# EAGLE schematic Prototipo_1.0 (EAGLE 6.1)
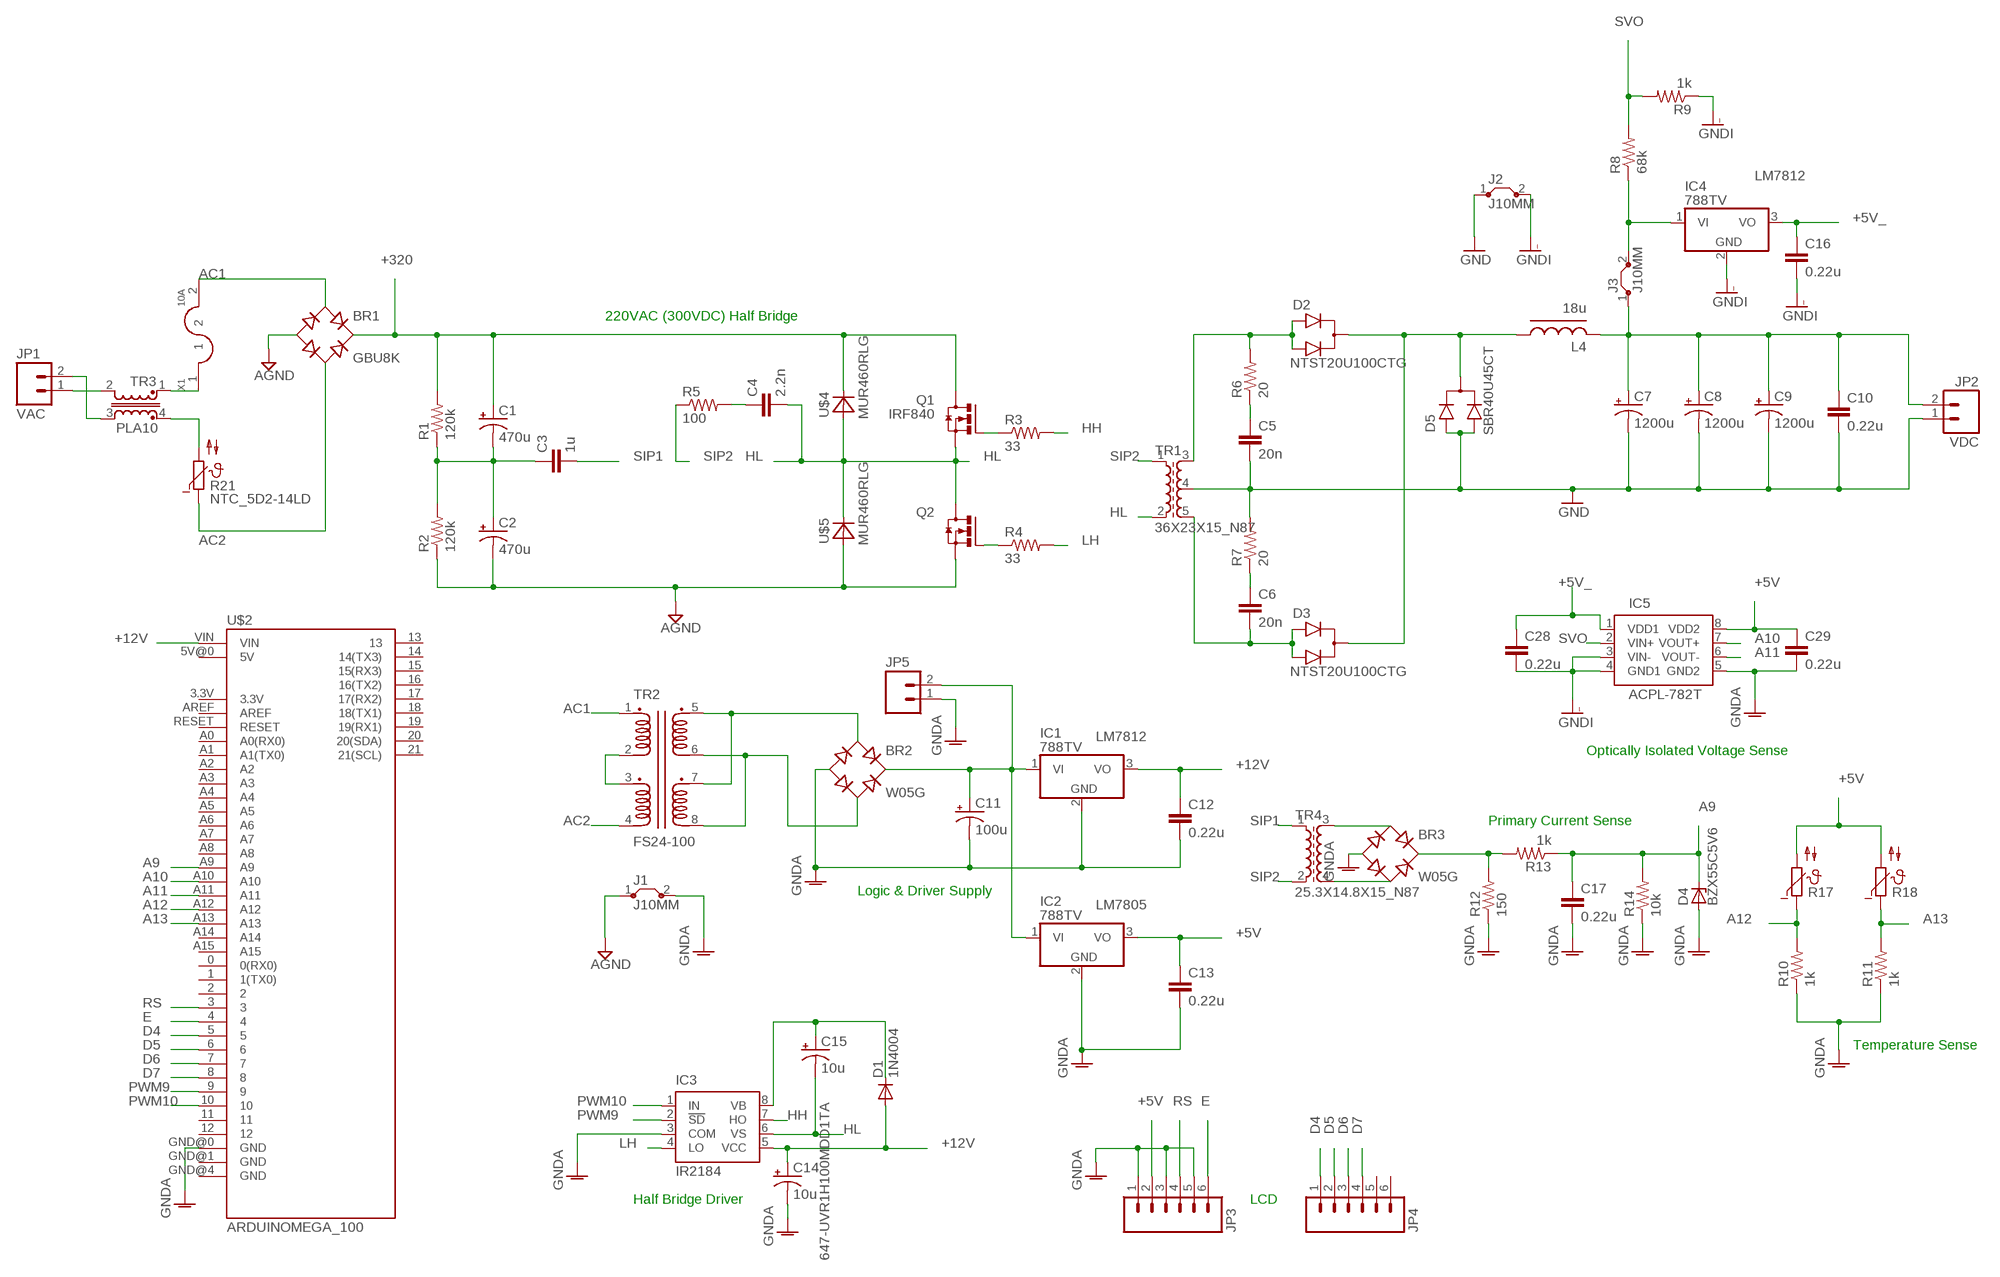
[diagram p0: schematic, sheet 1]

## Parts
BR1  GBU8K  [GBU]
BR2  W05G  [WOG]
BR3  W05G  [WOG]
C1  470u  CAP_470UF_250V  [CPOL_RADIAL_470UF_250V]
C2  470u  CAP_470UF_250V  [CPOL_RADIAL_470UF_250V]
C3  1u  C22/8  [C22.5B8]
C4  2.2n  C7.5/4  [C7.5B4]
C5  20n  C10/4  [C10B4]
C6  20n  C10/4  [C10B4]
C7  1200u  CAP_POLPTH4  [CPOL-RADIAL-1000UF-25V]
C8  1200u  CAP_POLPTH4  [CPOL-RADIAL-1000UF-25V]
C9  1200u  CAP_POLPTH4  [CPOL-RADIAL-1000UF-25V]
C10  0.22u  C5/3  [C5B3]
C11  100u  CPOL-USE3.5-8  [E3,5-8]
C12  0.22u  C5/3  [C5B3]
C13  0.22u  C5/3  [C5B3]
C14  10u  CPOL-USE2,5-6E  [E2,5-6E]
C15  10u  CPOL-USE2,5-6E  [E2,5-6E]
C16  0.22u  C5/3  [C5B3]
C17  0.22u  C5/3  [C5B3]
C28  0.22u  C5/3  [C5B3]
C29  0.22u  C5/3  [C5B3]
D1  1N4004  [DO41-10]
D2  NTST20U100CTG  [TO220V]
D3  NTST20U100CTG  [TO220V]
D4  BZX55C5V6  BZX55  [DO35Z10]
D5  SBR40U45CT  [TO220V]
IC1  788TV  [TO220V]
IC2  788TV  [TO220V]
IC3  IR2184  [DIL08]
IC4  788TV  [TO220V]
IC5  ACPL-782T  [DIL08]
J1  J10MM  [10]
J2  J10MM  [10]
J3  J10MM  [10]
JP1  VAC  M023.5MM  [SCREWTERMINAL-3.5MM-2]
JP2  VDC  M025MM  [SCREWTERMINAL-5MM-2]
JP3  M06SIP  [1X06]
JP4  M06SIP  [1X06]
JP5  M02LOCK_LONGPADS  [1X02_LOCK_LONGPADS]
L4  18u  CHOKE_18U  [CHOKE_18U]
Q1  IRF840  [TO220HV]
Q2  IRF840  [TO220HV]
R1  120k  RESISTORPTH-1/4W  [AXIAL-0.4]
R2  120k  RESISTORPTH-1/4W  [AXIAL-0.4]
R3  33  RESISTORPTH-1/2W  [AXIAL-0.5]
R4  33  RESISTORPTH-1/2W  [AXIAL-0.5]
R5  100  R-US_0922V  [0922V]
R6  20  RESISTORPTH-1/2W  [AXIAL-0.5]
R7  20  RESISTORPTH-1/2W  [AXIAL-0.5]
R8  68k  RESISTORPTH-1/4W  [AXIAL-0.4]
R9  1k  RESISTORPTH-1/4W  [AXIAL-0.4]
R10  1k  RESISTORPTH-1/4W  [AXIAL-0.4]
R11  1k  RESISTORPTH-1/4W  [AXIAL-0.4]
R12  150  RESISTORPTH-1/4W  [AXIAL-0.4]
R13  1k  RESISTORPTH-1/4W  [AXIAL-0.4]
R14  10k  RESISTORPTH-1/4W  [AXIAL-0.4]
R17  NTC640  [P640]
R18  NTC640  [P640]
R21  NTC_5D2-14LD  [C075-042X103]
TR1  36X23X15_N87  [CORE_36X23X15]
TR2  FS24-100  [FS24-100]
TR3  PLA10  COMMON_MODE_CHOKE_PLA10  [COMMON_MODE_CHOKE_PLA10]
TR4  25.3X14.8X15_N87  [CORE_25.3X14.8X15]
U$2  ARDUINOMEGA_100  [ARDUINOMEGA_100]
U$4  MUR460RLG  [CB429-17]
U$5  MUR460RLG  [CB429-17]
X1  10A  FUSE_HOLDER_5X20  [FUSE_HOLDER_5X20]

## Nets
$N15 [LVHC]: D2.2(C) D3.2(C) D5.2(C) L4.1
+5V: C13.1 C29.1 IC2.3(VO) IC5.8(VDD2) JP3.2 R17.2 R18.2
+5V_ [LVLC]: C16.1 C28.1 IC4.3(VO) IC5.1(VDD1)
+12V [HVMC]: C12.1 C14.+ D1.A IC1.3(VO) IC3.5(VCC) U$2.VIN
+320 [HVHC]: BR1.4(+) C1.1(+) Q1.2(D) R1.P$2 U$4.C
A9: C17.1 D4.C R13.P$1 R14.P$2 U$2.A9
A10: IC5.7(VOUT+) U$2.A10
A11: IC5.6(VOUT-) U$2.A11
A12: R10.P$2 R17.1 U$2.A12
A13: R11.P$2 R18.1 U$2.A13
AC1 [HVHC]: BR1.2(AC1) TR2.1(P1.1) X1.2
AC2 [HVHC]: BR1.3(AC2) R21.1 TR2.4(P2.2)
AGND [HVHC]: BR1.1(-) C2.2(-) J1.1 Q2.3(S) R2.P$1 U$5.A
D4: JP4.1 U$2.5
D5: JP4.2 U$2.6
D6: JP4.3 U$2.7
D7: JP4.4 U$2.8
E: JP3.6 U$2.4
GND [LVHC]: C5.2 C7.2(-) C8.2(-) C9.2(-) C10.2 D5.1(A1) D5.3(A2) J2.1 JP2.1 R7.P$2 TR1.4
GNDA [HVHC]: BR2.- BR3.- C11.- C12.2 C13.2 C14.- C17.2 C29.2 D4.A IC1.2(GND) IC2.2(GND) IC3.3(COM) IC5.5(GND2) J1.2 JP3.1 JP3.3 JP3.5 JP5.1 R10.P$1 R11.P$1 R12.P$1 R14.P$1 U$2.GND@0(GND)
GNDI [LVLC]: C16.2 C28.2 IC4.2(GND) IC5.3(VIN-) IC5.4(GND1) J2.2 R9.P$1
HH: IC3.7(HO) R3.P$2
HL [HVHC]: C4.2 C15.- IC3.6(VS) Q1.3(S) Q2.2(D) TR1.2 U$4.A U$5.C
LH: IC3.4(LO) R4.P$2
N$1 [HVHC]: TR2.2(P1.2) TR2.3(P2.1)
N$2 [HVHC]: R21.2 TR3.4
N$3 [HVHC]: C1.2(-) C2.1(+) C3.1 R1.P$1 R2.P$2
N$4 [LVLC]: IC4.1(VI) J3.2 R8.P$1
N$5 [HVHC]: TR3.1 X1.1
N$6: BR3.AC1 TR4.3
N$7 [HVHC]: C4.1 R5.2
N$8 [HVHC]: JP1.1 TR3.2
N$9 [HVHC]: JP1.2 TR3.3
N$10: Q1.1(G) R3.P$1
N$11: Q2.1(G) R4.P$1
N$12 [LVHC]: C5.1 R6.P$1
N$13 [LVHC]: D2.1(A1) D2.3(A2) R6.P$2 TR1.3
N$14 [LVSHC]: C7.1(+) C8.1(+) C9.1(+) C10.1 J3.1 JP2.2 L4.2
N$15 [HVMC]: BR2.AC1 TR2.5(S1.1) TR2.7(S2.1)
N$16: BR3.AC2 TR4.4
N$17 [LVHC]: C6.1 R7.P$1
N$18: BR3.+ R12.P$2 R13.P$2
N$19 [LVHC]: C6.2 D3.1(A1) D3.3(A2) TR1.5
N$20 [HVMC]: BR2.AC2 TR2.6(S1.2) TR2.8(S2.2)
N$21 [HVMC]: BR2.+ C11.+ IC1.1(VI) IC2.1(VI) JP5.2
N$26: C15.+ D1.C IC3.8(VB)
PWM9: IC3.2(!SD) U$2.9
PWM10: IC3.1(IN) U$2.10
RS: JP3.4 U$2.3
SIP1: C3.2 TR4.1
SIP2 [HVHC]: R5.1 TR1.1 TR4.2
SVO [LVLC]: IC5.2(VIN+) R8.P$2 R9.P$2
Unconnected: JP4.5 JP4.6 U$2.0(0(RX0)) U$2.1(1(TX0)) U$2.2 U$2.3.3V U$2.5V@0(5V) U$2.11 U$2.12 U$2.13 U$2.14(14(TX3)) U$2.15(15(RX3)) U$2.16(16(TX2)) U$2.17(17(RX2)) U$2.18(18(TX1)) U$2.19(19(RX1)) U$2.20(20(SDA)) U$2.21(21(SCL)) U$2.A0(A0(RX0)) U$2.A1(A1(TX0)) U$2.A2 U$2.A3 U$2.A4 U$2.A5 U$2.A6 U$2.A7 U$2.A8 U$2.A14 U$2.A15 U$2.AREF U$2.GND@1(GND) U$2.GND@4(GND) U$2.RESET

## Notes on the sheet
- 220VAC (300VDC) Half Bridge
- Optically Isolated Voltage Sense
- Primary Current Sense
- Logic & Driver Supply
- Temperature Sense
- Half Bridge Driver | LCD

## Library data of the parts
BR1 = finger_sun:GBU8K
BR2 = dbridge:W*G: Vishay/General Semiconductor W005G - W10G Bridge rectifier, 1.5A, 50 to 1000V; MOUSER: 625-W06G-E4
BR3 = dbridge:W*G: Vishay/General Semiconductor W005G - W10G Bridge rectifier, 1.5A, 50 to 1000V
C1 C2 = finger_sun:CAP_470UF_250V: Capacitor Polarized These are standard SMD and PTH capacitors. Normally 10uF, 47uF, and 100uF in electrolytic and tantalum varieties. Always verify the external diameter of the through hole cap, it varies with capacity, voltage, and manufacturer. The EIA devices should be standard.
C3 C4 = capacitor-wima:C: CAPACITOR naming: grid - package width
C5 C6 = capacitor-wima:C: CAPACITOR naming: grid - package width; MOUSER: 594-S203M75Z5UN63J0R
C7-C9 = SparkFun-Passives:CAP_POL: Capacitor Polarized These are standard SMD and PTH capacitors. Normally 10uF, 47uF, and 100uF in electrolytic and tantalum varieties. Always verify the external diameter of the through hole cap, it varies with capacity, voltage, and manufacturer. The EIA devices should be standard.; MOUSER: 667-EEU-FR1V122B
C10 C12 C13 C16 C17 C28 C29 = capacitor-wima:C: CAPACITOR naming: grid - package width; MOUSER: 80-R82DC3220AA60K
C11 = adafruit:CPOL-US: POLARIZED CAPACITOR, American symbol; MOUSER: 140-REA101M1HBK0811P
C14 C15 = adafruit:CPOL-US: POLARIZED CAPACITOR, American symbol; MOUSER: 647-UVR1H100MDD1TA
D1 = diode:1N4004: DIODE general purpose rectifier, 1 A; MOUSER: 512-1N4007
D2 D3 = finger_sun:NTST20U100CTG
D4 = diode:BZX55: Z DIODE; MOUSER: 78-BZX55C5V6-TAP
D5 = finger_sun:SBR40U45CT
IC1 = linear:78*: Positive VOLTAGE REGULATOR Source: http://cache.national.com/ds/LM/LM78L05.pdf http://www.fairchildsemi.com/ds/LM/LM7805.pdf; MODEL: LM7812; MOUSER: 863-MC7812CTG
IC2 = linear:78*: Positive VOLTAGE REGULATOR Source: http://cache.national.com/ds/LM/LM78L05.pdf http://www.fairchildsemi.com/ds/LM/LM7805.pdf; MODEL: LM7805; MOUSER: 863-MC7805CTG
IC3 = finger_sun:IR2184: HALF-BRIDGE DRIVER www.irf.com Data Sheet No. PD60174 revG Features *Floating channel designed for bootstrap operation Fully operational to +600V *Tolerant to negative transient voltage dV/dt immune * Gate drive supply range from 10 to 20V * Undervoltage lockout for both channels * 3.3V and 5V input logic compatible * Matched propagation delay for both channels * Logic and power ground +/- 5V offset. * Lower di/dt gate driver for better noise immunity * Output source/sink current capability 1.4A/1.8A * Also available LEAD-FREE (PbF); MF: INTERNATIONAL RECTIFIER(IR); MPN: IR2184
IC4 = linear:78*: Positive VOLTAGE REGULATOR Source: http://cache.national.com/ds/LM/LM78L05.pdf http://www.fairchildsemi.com/ds/LM/LM7805.pdf; MODEL: LM7812; MOUSER: 863-MC7805CTG
IC5 = finger_sun:ACPL-782T
J1-J3 = jumper:J: Bridge
JP1 JP2 JP5 = SparkFun-Connectors:M02: Header 2 Standard 2-pin 0.1" header. Use with straight break away headers (SKU : PRT-00116), right angle break away headers (PRT-00553), swiss pins (PRT-00743), machine pins (PRT-00117), and female headers (PRT-00115). Molex polarized connector foot print use with SKU : PRT-08233 with associated crimp pins and housings.
JP3 JP4 = SparkFun-Connectors:M06: Header 6 Standard 6-pin 0.1" header. Use with straight break away headers (SKU : PRT-00116), right angle break away headers (PRT-00553), swiss pins (PRT-00743), machine pins (PRT-00117), and female headers (PRT-00115). Molex polarized connector foot print use with SKU : PRT-08094 with associated crimp pins and housings. NOTES ON THE VARIANTS LOCK and LOCK_LONGPADS... This footprint was designed to help hold the alignment of a through-hole component (i.e. 6-pin header) while soldering it into place. You may notice that each hole has been shifted either up or down by 0.005 of an inch from it's more standard position (which is a perfectly straight line). This slight alteration caused the pins (the squares in the middle) to touch the edges of the holes. Because they are alternating, it causes a "brace" to hold the component in place. 0.005 has proven to be the perfect amount of "off-center" position when using our standard breakaway headers. Although looks a little odd when you look at the bare footprint, once you have a header in there, the alteration is very hard to notice. Also, if you push a header all the way into place, it is covered up entirely on the bottom side. This idea of altering the position of holes to aid alignment will be further integrated into the Sparkfun Library for other footprints. It can help hold any component with 3 or more connection pins.
L4 = finger_sun:CHOKE_18U: Choke Toroid 18uH 18.5A 652-2300LL-180-V-RC
Q1 Q2 = finger_sun:IRF840
R1 R2 = SparkFun-Passives:RESISTOR: Resistor Basic schematic elements and footprints for 0603, 1206, and PTH resistors.; MOUSER: 660-MF1/4DCT52R1203F
R3 R4 = SparkFun-Passives:RESISTOR: Resistor Basic schematic elements and footprints for 0603, 1206, and PTH resistors.
R5 = adafruit:R-US_: RESISTOR, American symbol
R6 R7 = SparkFun-Passives:RESISTOR: Resistor Basic schematic elements and footprints for 0603, 1206, and PTH resistors.; MOUSER: 603-MFR50SFTE52-20R
R8 = SparkFun-Passives:RESISTOR: Resistor Basic schematic elements and footprints for 0603, 1206, and PTH resistors.; MOUSER: 660-MF1/4DC6802F
R9-R11 R13 = SparkFun-Passives:RESISTOR: Resistor Basic schematic elements and footprints for 0603, 1206, and PTH resistors.; MOUSER: 660-MF1/4DC1001F
R12 = SparkFun-Passives:RESISTOR: Resistor Basic schematic elements and footprints for 0603, 1206, and PTH resistors.; MOUSER: 660-MF1/4DC1500F
R14 = SparkFun-Passives:RESISTOR: Resistor Basic schematic elements and footprints for 0603, 1206, and PTH resistors.; MOUSER: 660-MF1/4DC1002F
R17 R18 = ptc-ntc:NTC640: PHILIPS NTC; MOUSER: 594-NTCLE203E3502JB0; OC_FARNELL: unknown; OC_NEWARK: unknown
R21 = finger_sun:NTC_5D2-14LD
TR1 = finger_sun:36X23X15_N87
TR2 = finger_sun:FS24-100: Transformer 110+110/12+12 2.5VA Triad Magnetics FS24-100; MOUSER: 553-FS24-100
TR3 = finger_sun:COMMON_MODE_CHOKE_PLA10: Common Mode Choke (EMI Filter) PLA10
TR4 = finger_sun:25.3X14.8X15_N87
U$2 = prymia:ARDUINOMEGA_100
U$4 U$5 = finger_sun:MUR460RLG
X1 = finger_sun:FUSE_HOLDER_5X20: Fuse Holder - Fuse Cartridge 5x20mm

## Net classes
0 HVLC: clearance 0.889 mm
1 HVHC: width 0.762 mm, clearance 1.27 mm to class 0, clearance 1.27 mm
2 LVHC: width 2.794 mm, clearance 5.08 mm to class 0, clearance 5.08 mm to class 1
3 LVLC: width 0.381 mm, clearance 5.08 mm to class 0, clearance 5.08 mm to class 1
4 LVSHC: width 5.08 mm, clearance 5.08 mm to class 0, clearance 5.08 mm to class 1
5 HVMC: width 0.762 mm, clearance 0.889 mm to class 0, clearance 1.27 mm to class 1, clearance 5.08 mm to class 2, clearance 5.08 mm to class 3, clearance 5.08 mm to class 4, clearance 0.889 mm